# Altium schematic sheet EFR32.SchDoc: Micro-Controller
size A4; Address3: Self Checkout Shopping Cart; DocumentNumber: 1; Revision: 1.0; SheetNumber: 5; SheetTotal: 7
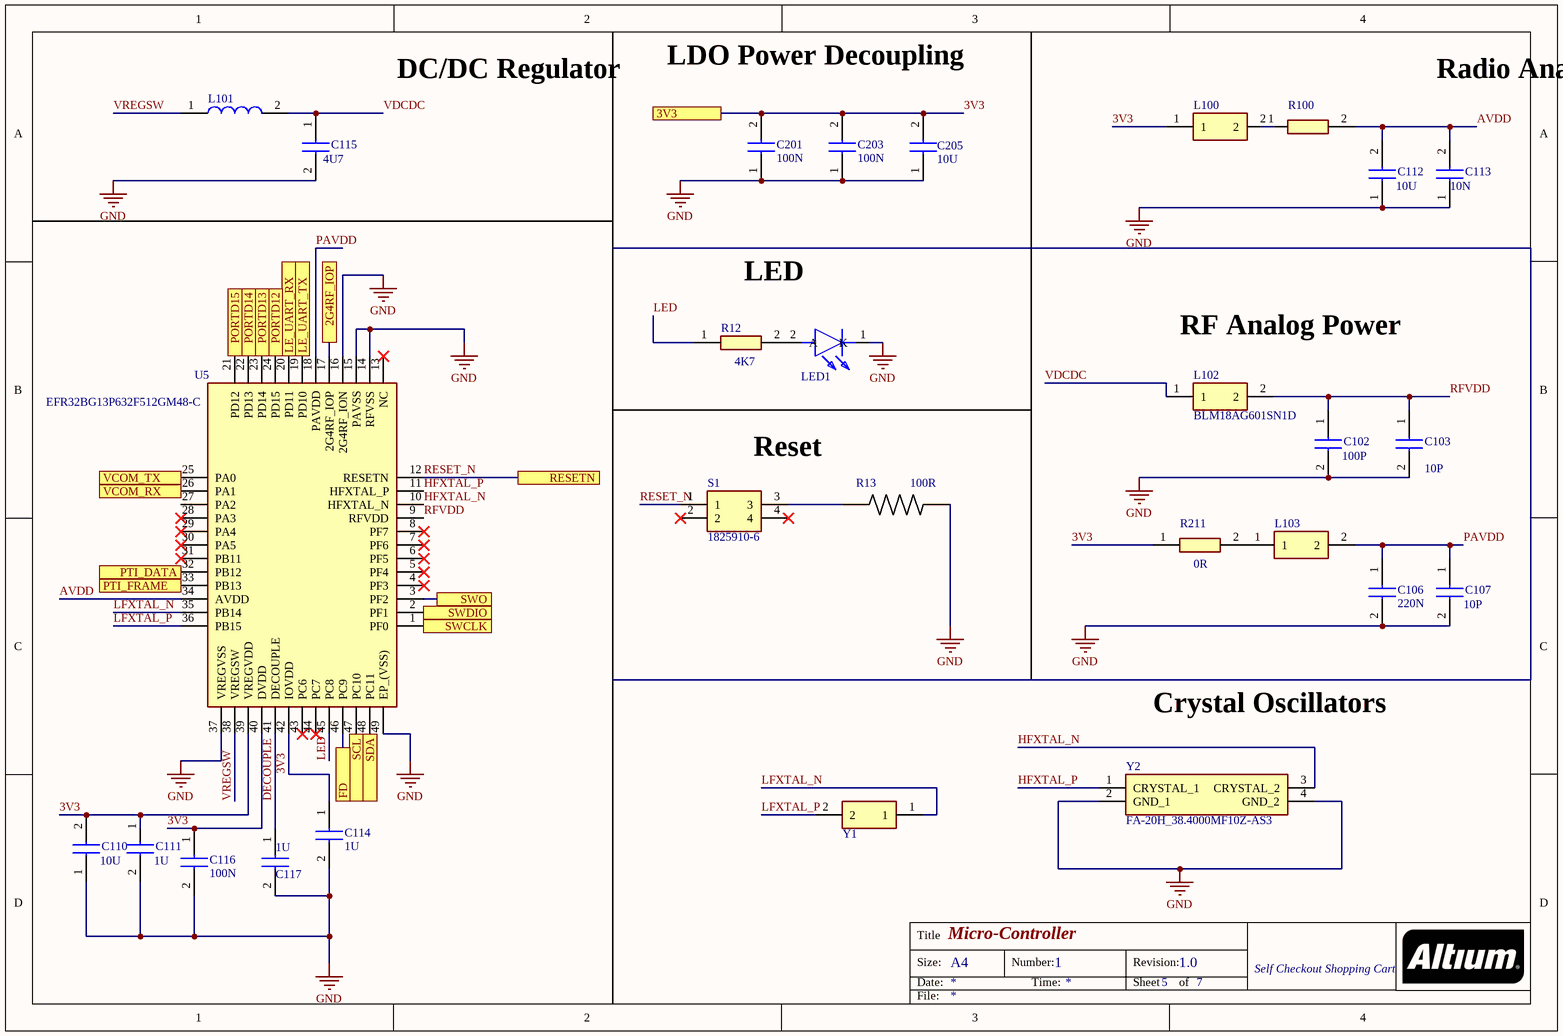
[diagram p0: EFR32.SchDoc]

## Parts
C102  value 100P  [CAPC1608X90N]  (hidden comment: GCM1885C1H101JA16D)
C103  value 10P  [CAPC1608X90N]  (hidden comment: GRM1885C1H100JA01D)
C106  value 220N  [CAPC1608X90N]  (hidden comment: GRM188R71C224KA01D)
C107  value 10P  [CAPC1608X90N]  (hidden comment: GRM1885C1H100JA01D)
C110  value 10U  [CAPC1608X90N]  (hidden comment: GRM188R60J106ME84D)
C111  value 1U  [CAPC1608X90N]  (hidden comment: GRM188R61E105KAADD)
C112  value 10U  [CAPC1608X90N]  (hidden comment: GRM188R60J106ME84D)
C113  value 10N  [CAPC1608X90N]  (hidden comment: CC0603KRX7R7BB103)
C114  value 1U  [CAPC1608X90N]  (hidden comment: GRM188R61E105KAADD)
C115  value 4U7  [CAPC1608X90N]  (hidden comment: GRM188R61E475KE11D)
C116  value 100N  [CAPC1608X90N]  (hidden comment: GCM188R71C104KA37D)
C117  value 1U  [CAPC1608X90N]  (hidden comment: GRM188R61E105KAADD)
C201  value 100N  [CAPC1608X90N]  (hidden comment: GCM188R71C104KA37D)
C203  value 100N  [CAPC1608X90N]  (hidden comment: GCM188R71C104KA37D)
C205  value 10U  [CAPC1608X90N]  (hidden comment: GRM188R61C106KAALJ)
L100  74279266  [BEADC1608X100N]  (value not drawn)
L101  SRN3015-4R7M  [INDPM3027X150N]  (value not drawn)
L102  BLM18AG601SN1D  [BEADC1608X95N]
L103  BLM18AG601SN1D  [BEADC1608X95N]  (value not drawn)
LED1  SML-D12U1WT86  [LEDC1608X65N]  (value not drawn)
R12  value 4K7  [RESC1608X50N]  (hidden comment: RCS06034K70FKEA)
R13  value 100R  [*RESC1608X55N]  (hidden comment: 1-2176326-3)
R100  CRCW02011R00FXED  [RESC0603X28N]  (value not drawn)
R211  value 0R  [RESC0603X28N]  (hidden comment: CRCW02010000Z0ED)
S1  1825910-6  [1825910-6]
U5  EFR32BG13P632F512GM48-C  [*QFN40P600X600X100-49N]
Y1  CM8V-T1A-32.768kHz-12.5pF-20PPM-TA-QC  [CM8V32768TA020125]  (value not drawn)
Y2  FA-20H_38.4000MF10Z-AS3  [FA20H300000MF20XW]

## Ports
2G4RF_IOP, 3V3, FD, LE_UART_RX, LE_UART_TX, PORTD12, PORTD13, PORTD14, PORTD15, PTI_DATA, PTI_FRAME, RESETN, SCL, SDA, SWCLK, SWDIO, SWO, VCOM_RX, VCOM_TX

## Nets
GND: C102.2 C103.2 C106.2 C107.2 C110.1 C111.2 C112.1 C113.1 C114.2 C115.2 C116.2 C117.2 C201.1 C203.1 C205.1 LED1.1(K) R13.2 U5.14(RFVSS) U5.15(PAVSS) U5.16(2G4RF_ION) U5.37(VREGVSS) U5.49(EP_(VSS)) Y2.2(GND_1) Y2.4(GND_2)
2G4RF_IOP: U5.17(2G4RF_IOP) ; port 2G4RF_IOP
3V3: C110.2 C111.1 C114.1 C116.1 C201.2 C203.2 C205.2 L100.1 R211.1 U5.39(VREGVDD) U5.40(DVDD) U5.42(IOVDD) ; port 3V3
AVDD: C112.2 C113.2 R100.2 U5.34(AVDD)
DECOUPLE: C117.1 U5.41(DECOUPLE)
FD: U5.46(PC9) ; port FD
HFXTAL_N: U5.10(HFXTAL_N) Y2.3(CRYSTAL_2)
HFXTAL_P: U5.11(HFXTAL_P) Y2.1(CRYSTAL_1)
LE_UART_RX: U5.20(PD11) ; port LE_UART_RX
LE_UART_TX: U5.19(PD10) ; port LE_UART_TX
LED: R12.1 U5.45(PC8)
LFXTAL_N: U5.35(PB14) Y1.1
LFXTAL_P: U5.36(PB15) Y1.2
PAVDD: C106.1 C107.1 L103.2 U5.18(PAVDD)
PORTD12: U5.24(PD15) ; port PORTD12
PORTD13: U5.23(PD14) ; port PORTD13
PORTD14: U5.22(PD13) ; port PORTD14
PORTD15: U5.21(PD12) ; port PORTD15
PTI_DATA: U5.32(PB12) ; port PTI_DATA
PTI_FRAME: U5.33(PB13) ; port PTI_FRAME
RESET_N: S1.1 U5.12(RESETN) ; port RESETN
RFVDD: C102.1 C103.1 L102.2 U5.9(RFVDD)
SCL: U5.47(PC10) ; port SCL
SDA: U5.48(PC11) ; port SDA
SWCLK: U5.1(PF0) ; port SWCLK
SWDIO: U5.2(PF1) ; port SWDIO
SWO: U5.3(PF2) ; port SWO
VCOM_RX: U5.26(PA1) ; port VCOM_RX
VCOM_TX: U5.25(PA0) ; port VCOM_TX
VDCDC: C115.1 L101.2 L102.1
VREGSW: L101.1 U5.38(VREGSW)
NetL100_2: L100.2 R100.1
NetL103_1: L103.1 R211.2
NetLED1_2: LED1.2(A) R12.2
NetR13_1: R13.1 S1.3

Not connected (* = marked no-connect by the designer): S1 2* 4*; U5 4(PF3)* 5(PF4)* 6(PF5)* 7(PF6)* 8(PF7)* 13(NC)* 27(PA2) 28(PA3)* 29(PA4)* 30(PA5)* 31(PB11)* 43(PC6)* 44(PC7)*

## Notes on the sheet
- (near L101) DC/DC Regulator
- LDO Power Decoupling
- Radio Analog Supply
- LED
- RF Analog Power
- Reset
- Crystal Oscillators
- Title
- Size:
- Date:
- A4
- Number:
- Time:
- Revision:
- Sheet
- of
- File:

## Library data of the parts
C102 = GCM1885C1H101JA16D: Capacitor; Manufacturer_Name: Murata Electronics; Datasheet Link: https://componentsearchengine.com/Datasheets/2/GCM1885C1H101JA16D.pdf; Height: 0.9mm; Manufacturer_Part_Number: GCM1885C1H101JA16D; Mouser Part Number: 81-GCM1885C1H101JA6D; Mouser Price/Stock: https://www.mouser.com/Search/Refine.aspx?Keyword=81-GCM1885C1H101JA6D; RS Part Number: 7235014; RS Price/Stock: https://uk.rs-online.com/web/p/products/7235014
C103 C107 = GRM1885C1H100JA01D: Capacitor; Manufacturer_Name: Murata Electronics; Datasheet Link: http://psearch.en.murata.com/capacitor/product/GRM1885C1H100JA01%23.pdf; Height: 0.9mm; Manufacturer_Part_Number: GRM1885C1H100JA01D; Mouser Part Number: 81-GRM39C100D50; Mouser Price/Stock: https://www.mouser.com/Search/Refine.aspx?Keyword=81-GRM39C100D50; RS Part Number: 6242339P; RS Price/Stock: http://uk.rs-online.com/web/p/products/6242339P
C106 = GRM188R71C224KA01D: Capacitor; Manufacturer_Name: Murata Electronics; Manufacturer_Part_Number: CC0603KPX77BB224; Datasheet Link: http://www.murata.com/~/media/webrenewal/support/library/catalog/products/capacitor/mlcc/c02e.pdf; Height: 0.9mm; Mouser Part Number: 603-CC0603KPX77BB224; Mouser Price/Stock: https://www.mouser.com/Search/Refine.aspx?Keyword=81-GRM188R71C224KA01; RS Part Number: 7235610; RS Price/Stock: https://uk.rs-online.com/web/p/products/7235610
C110 C112 = GRM188R60J106ME84D: Capacitor; Manufacturer_Name: Murata Electronics; Datasheet Link: http://www.murata.com/~/media/webrenewal/support/library/catalog/products/capacitor/mlcc/c02e.pdf; Height: 0.9mm; Manufacturer_Part_Number: GRM188R60J106ME84D; Mouser Part Number: 81-GRM188R60J106ME4D; Mouser Price/Stock: https://www.mouser.com/Search/Refine.aspx?Keyword=81-GRM188R60J106ME4D; RS Part Number: 8847242P; RS Price/Stock: http://uk.rs-online.com/web/p/products/8847242P
C111 C114 C117 = GRM188R61E105KAADD: Capacitor; Manufacturer_Name: Murata Electronics; Datasheet Link: http://www.murata.com/~/media/webrenewal/support/library/catalog/products/capacitor/mlcc/c02e.pdf; Height: 0.9mm; Manufacturer_Part_Number: GRM188R61E105KAADD; Mouser Part Number: 81-GRM188R61E105KADD; Mouser Price/Stock: https://www.mouser.com/Search/Refine.aspx?Keyword=81-GRM188R61E105KADD; RS Part Number: 8467290P; RS Price/Stock: http://uk.rs-online.com/web/p/products/8467290P
C113 = CC0603KRX7R7BB103: Capacitor; Manufacturer_Name: YAGEO (PHYCOMP); Datasheet Link: http://www.yageo.com/documents/recent/UPY-GPHC_X7R_6.3V-to-50V_18.pdf; Height: 0.9mm; Manufacturer_Part_Number: CC0603KRX7R7BB103; Mouser Part Number: 603-CC603KRX7R7BB103; Mouser Price/Stock: https://www.mouser.com/Search/Refine.aspx?Keyword=603-CC603KRX7R7BB103
C115 = GRM188R61E475KE11D: Capacitor; Manufacturer_Name: Murata Electronics; Datasheet Link: https://psearch.en.murata.com/capacitor/product/GRM188R61E475KE11%23.html; Height: 0.9mm; Manufacturer_Part_Number: GRM188R61E475KE11D; Mouser Part Number: 81-GRM188R61E475KE1D; Mouser Price/Stock: https://www.mouser.com/Search/Refine.aspx?Keyword=81-GRM188R61E475KE1D; RS Part Number: 8151386P; RS Price/Stock: http://uk.rs-online.com/web/p/products/8151386P
C116 C201 C203 = GCM188R71C104KA37D: Capacitor; Manufacturer_Name: Murata Electronics; Datasheet Link: https://psearch.en.murata.com/capacitor/product/GCM188R71C104KA37%23.pdf; Height: 0.9mm; Manufacturer_Part_Number: GCM188R71C104KA37D; Mouser Part Number: 81-GCM188R71C104KA7D; Mouser Price/Stock: https://www.mouser.com/Search/Refine.aspx?Keyword=81-GCM188R71C104KA7D; RS Part Number: 8151276; RS Price/Stock: http://uk.rs-online.com/web/p/products/8151276
C205 = GRM188R61C106KAALJ: Capacitor; Manufacturer_Name: Murata Electronics; Datasheet Link: https://psearch.en.murata.com/capacitor/product/GRM188R61C106KAAL%23.html; Height: 0.9mm; Manufacturer_Part_Number: GRM188R61C106KAALJ; Mouser Part Number: 81-GRM188R61C106KALJ; Mouser Price/Stock: https://www.mouser.com/Search/Refine.aspx?Keyword=81-GRM188R61C106KALJ
L100 = 74279266: Ferrite Bead; Manufacturer_Name: Wurth Elektronik; Datasheet Link: http://uk.rs-online.com/web/p/products/3674856; Height: 1mm; Manufacturer_Part_Number: 74279266; Mouser Part Number: 710-74279266; Mouser Price/Stock: https://www.mouser.com/Search/Refine.aspx?Keyword=710-74279266; RS Part Number: 1241858P; RS Price/Stock: http://uk.rs-online.com/web/p/products/1241858P
L101 = SRN3015-4R7M: Inductor; Manufacturer_Name: Bourns; Allied_Number: 70230754; Datasheet Link: https://www.bourns.com/docs/Product-Datasheets/SRN3015.pdf; Height: 1.5mm; Manufacturer_Part_Number: SRN3015-4R7M; Mouser Part Number: 652-SRN3015-4R7M; Mouser Price/Stock: https://www.mouser.com/Search/Refine.aspx?Keyword=652-SRN3015-4R7M; RS Part Number: 7435068; RS Price/Stock: https://uk.rs-online.com/web/p/products/7435068; Allied Price/Stock: https://www.alliedelec.com/bourns-srn3015-4r7m/70230754/
L102 L103 = BLM18AG601SN1D: Filter; Manufacturer_Name: Murata Electronics; Datasheet Link: https://www.murata.com/en-us/products/productdetail?partno=BLM18AG601SN1%23; Height: 0.95mm; Manufacturer_Part_Number: BLM18AG601SN1D; Mouser Part Number: 81-BLM11A601S; Mouser Price/Stock: https://www.mouser.com/Search/Refine.aspx?Keyword=81-BLM11A601S; RS Part Number: 0110380; RS Price/Stock: http://uk.rs-online.com/web/p/products/0110380
LED1 = SML-D12U1WT86: LED; Manufacturer_Name: ROHM Semiconductor; Datasheet Link: https://componentsearchengine.com/Datasheets/1/SML-D12U1WT86.pdf; Height: 0.65mm; Manufacturer_Part_Number: SML-D12U1WT86; Mouser Part Number: 755-SML-D12U1WT86; Mouser Price/Stock: https://www.mouser.com/Search/Refine.aspx?Keyword=755-SML-D12U1WT86; RS Part Number: 1332870P; RS Price/Stock: http://uk.rs-online.com/web/p/products/1332870P
R12 = RCS06034K70FKEA: Resistor; Manufacturer_Name: Vishay; Datasheet Link: https://www.vishay.com/docs/20065/rcse3.pdf; Height: 0.5mm; Manufacturer_Part_Number: RCS06034K70FKEA; Mouser Part Number: 71-RCS06034K70FKEA; Mouser Price/Stock: https://www.mouser.com/Search/Refine.aspx?Keyword=71-RCS06034K70FKEA
R13 = CRGP0603F100R: Fixed Resistor CRGP 0603 100R 1%; Manufacturer_Name: TE Connectivity; Detailed Description: 100 Ohms ±1% 0.25W, 1/4W Chip Resistor 0603 (1608 Metric) Pulse Withstanding Thick Film; Manufacturer_Part_Number: CRGP0603F100R; Package: 1608 Rohm Semiconductor; Digi-Key Part Number: A130404CT-ND; Digikey Price/Stock: https://www.digikey.com/products/en?keywords=A130404CT-ND
R100 = CRCW02011R00FXED: Resistor; Manufacturer_Name: Vishay; Datasheet Link: http://www.vishay.com/docs/20035/dcrcwe3.pdf; Height: 0.28mm; Manufacturer_Part_Number: CRCW02011R00FXED; Mouser Part Number: 71-CRCW02011R00FXED; Mouser Price/Stock: https://www.mouser.com/ProductDetail/Vishay-Dale/CRCW02011R00FXED?qs=%2Fha2pyFadui6t5gBae62oQRyxUBJXKblCCjJgQEYATm3qtSsMjWJCXYfShfmOL9Q
R211 = CRCW02010000Z0ED: Resistor; Manufacturer_Name: Vishay; Allied_Number: 70202068; Datasheet Link: http://www.vishay.com/docs/20035/dcrcwe3.pdf; Height: 0.28mm; Manufacturer_Part_Number: CRCW02010000Z0ED; Mouser Part Number: 71-CRCW02010000Z0ED; Mouser Price/Stock: https://www.mouser.com/Search/Refine.aspx?Keyword=71-CRCW02010000Z0ED; Allied Price/Stock: https://www.alliedelec.com/vishay-dale-crcw02010000z0ed/70202068/
S1 = 1825910-6: Switch; Manufacturer_Name: TE Connectivity; Datasheet Link: http://www.farnell.com/datasheets/921681.pdf; Manufacturer_Part_Number: 1825910-6; Mouser Part Number: 506-FSM4JH; Mouser Price/Stock: https://www.mouser.com/Search/Refine.aspx?Keyword=N%2FA; RS Part Number: 4791413P
U5 = EFR32BG13P632F512GM48-C: Integrated Circuit; Manufacturer_Name: Silicon Labs; Datasheet Link: https://www.silabs.com/documents/login/data-sheets/efr32bg13-datasheet.pdf; Height: 0.9mm; Manufacturer_Part_Number: EFR32BG13P632F512GM48-C; Mouser Part Number: 634-EFR32BG13P632-C; Mouser Price/Stock: https://www.mouser.com/Search/Refine.aspx?Keyword=634-EFR32BG13P632-C
Y1 = CM8V-T1A-32.768kHz-12.5pF-20PPM-TA-QC: Crystal or Oscillator; Manufacturer_Name: MICRO CRYSTAL; Datasheet Link: https://www.mouser.co.uk/datasheet/2/530/cm8v-t1a-1085761.pdf; Manufacturer_Part_Number: CM8V-T1A-32.768kHz-12.5pF-20PPM-TA-QC; Mouser Part Number: 428-201494-MC01; Mouser Price/Stock: https://www.mouser.com/Search/Refine.aspx?Keyword=428-201494-MC01
Y2 = FA-20H_38.4000MF10Z-AS3: Crystal or Oscillator; Manufacturer_Name: Epson Timing; Manufacturer_Part_Number: FA-20H 38.4000MF10Z-AS3; Datasheet Link: https://support.epson.biz/td/api/doc_check.php?dl=brief_FA-20H_en.pdf; Height: 0.55mm; Mouser Part Number: 732-FA20H38.4F10ZAS3; Mouser Price/Stock: https://www.mouser.com/Search/Refine.aspx?Keyword=732-FA20H38.4F10ZAS3